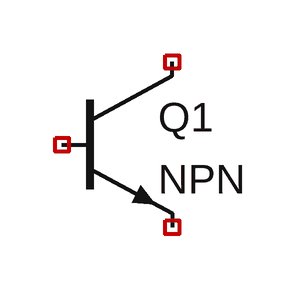
[diagram p0: schematic Draft2.asc]
Draft2.asc, the LTspice schematic file:
Version 4.1
SHEET 1 880 680
SYMBOL npn2 208 80 R0
SYMATTR InstName Q1

The netlist it stands for:
* Draft2.asc
Q1 NC_01 NC_02 NC_03 0 NPN
.model NPN NPN
.model PNP PNP
.lib standard.bjt
.backanno
.end